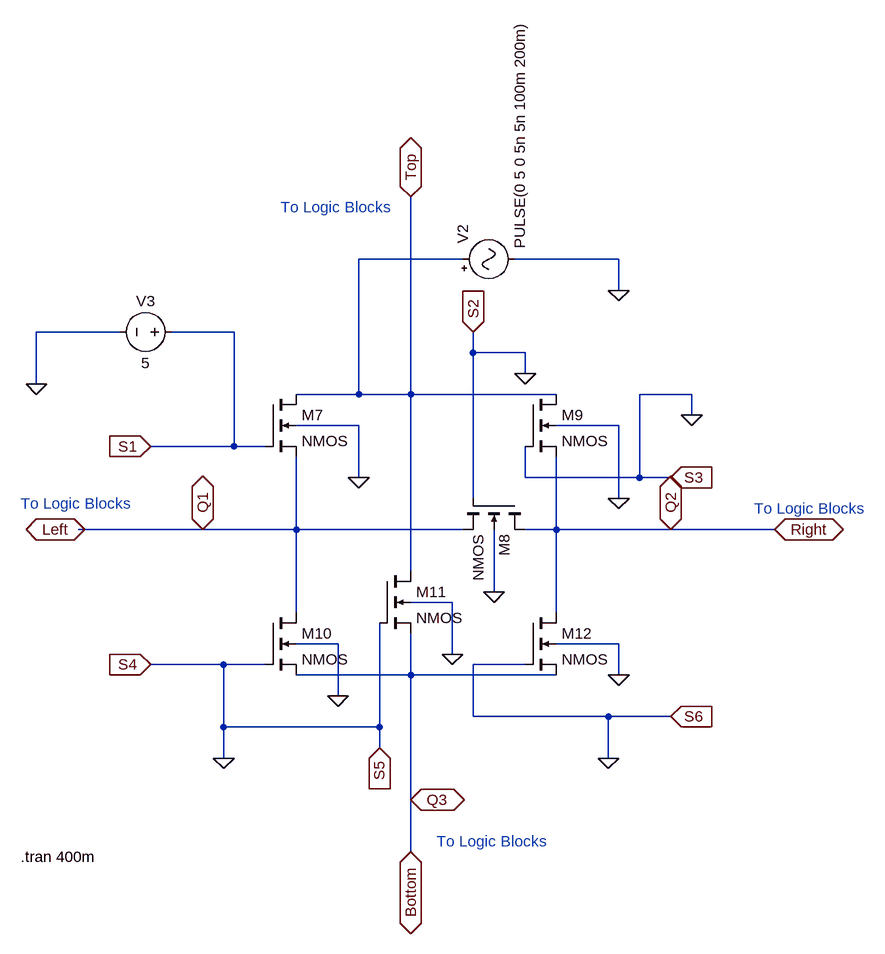
[diagram p0: schematic Circuit2_2_1.asc]
Circuit2_2_1.asc, the LTspice schematic file:
Version 4
SHEET 1 1812 896
WIRE 400 -160 240 -160
WIRE 640 -160 480 -160
WIRE 640 -112 640 -160
WIRE -128 -48 -256 -48
WIRE 48 -48 -48 -48
WIRE 416 -16 416 -48
WIRE 496 -16 416 -16
WIRE 496 16 496 -16
WIRE -256 32 -256 -48
WIRE 240 48 240 -160
WIRE 240 48 144 48
WIRE 320 48 320 -256
WIRE 320 48 240 48
WIRE 544 48 320 48
WIRE 752 48 672 48
WIRE 752 80 752 48
WIRE 240 96 144 96
WIRE 640 96 544 96
WIRE 48 128 48 -48
WIRE 48 128 -80 128
WIRE 96 128 48 128
WIRE 240 176 240 96
WIRE 496 176 496 128
WIRE 672 176 672 48
WIRE 672 176 496 176
WIRE 720 176 672 176
WIRE 416 208 416 -16
WIRE 640 208 640 96
WIRE 0 256 -192 256
WIRE 144 256 144 144
WIRE 144 256 0 256
WIRE 400 256 144 256
WIRE 544 256 544 144
WIRE 544 256 496 256
WIRE 720 256 544 256
WIRE 880 256 720 256
WIRE 320 320 320 48
WIRE 448 352 448 256
WIRE 384 368 320 368
WIRE 144 384 144 256
WIRE 544 384 544 256
WIRE 208 432 144 432
WIRE 640 432 544 432
WIRE 384 448 384 368
WIRE 32 464 -80 464
WIRE 96 464 32 464
WIRE 496 464 416 464
WIRE 320 480 320 416
WIRE 320 480 144 480
WIRE 544 480 320 480
WIRE 640 480 640 432
WIRE 208 512 208 432
WIRE 416 544 416 464
WIRE 624 544 416 544
WIRE 720 544 624 544
WIRE 32 560 32 464
WIRE 272 560 272 400
WIRE 272 560 32 560
WIRE 272 592 272 560
WIRE 32 608 32 560
WIRE 624 608 624 544
WIRE 320 672 320 480
WIRE 320 752 320 672
FLAG 240 176 0
FLAG 640 208 0
FLAG 448 352 0
FLAG 384 448 0
FLAG 640 480 0
FLAG 208 512 0
FLAG 320 -256 Top
IOPIN 320 -256 BiDir
FLAG 880 256 Right
IOPIN 880 256 BiDir
FLAG 320 752 Bottom
IOPIN 320 752 BiDir
FLAG -272 256 Left
IOPIN -272 256 BiDir
FLAG 416 -48 S2
IOPIN 416 -48 In
FLAG 720 176 S3
IOPIN 720 176 In
FLAG 720 544 S6
IOPIN 720 544 In
FLAG 272 592 S5
IOPIN 272 592 In
FLAG -80 464 S4
IOPIN -80 464 In
FLAG -80 128 S1
IOPIN -80 128 In
FLAG -256 32 0
FLAG 640 -112 0
FLAG 496 16 0
FLAG 752 80 0
FLAG 624 608 0
FLAG 32 608 0
FLAG 0 256 Q1
IOPIN 0 256 BiDir
FLAG 720 256 Q2
IOPIN 720 256 BiDir
FLAG 320 672 Q3
IOPIN 320 672 BiDir
SYMBOL nmos4 96 48 R0
SYMATTR InstName M7
SYMBOL nmos4 496 208 R90
SYMATTR InstName M8
SYMBOL nmos4 496 48 R0
SYMATTR InstName M9
SYMBOL nmos4 96 384 R0
SYMATTR InstName M10
SYMBOL nmos4 272 320 R0
SYMATTR InstName M11
SYMBOL nmos4 496 384 R0
SYMATTR InstName M12
SYMBOL Misc\\signal 384 -160 R270
WINDOW 3 16 104 Left 2
WINDOW 123 0 0 Left 0
WINDOW 39 0 0 Left 0
SYMATTR Value PULSE(0 5 0 5n 5n 100m 200m)
SYMATTR InstName V2
SYMBOL voltage -32 -48 R90
WINDOW 0 -32 56 VBottom 2
WINDOW 3 32 56 VTop 2
WINDOW 123 0 0 Left 0
WINDOW 39 0 0 Left 0
SYMATTR InstName V3
SYMATTR Value 5
TEXT 120 -240 Left 2 ;To Logic Blocks
TEXT 360 736 Left 2 ;To Logic Blocks
TEXT 848 224 Left 2 ;To Logic Blocks
TEXT -280 216 Left 2 ;To Logic Blocks
TEXT -280 760 Left 2 !.tran 400m

The netlist it stands for:
* Circuit2_2_1.asc
M7 Top S1 Q1 0 NMOS
M8 Q2 0 Q1 0 NMOS
M9 Top 0 Q2 0 NMOS
M10 Q1 0 Q3 0 NMOS
M11 Top 0 Q3 0 NMOS
M12 Q2 0 Q3 0 NMOS
V2 Top 0 PULSE(0 5 0 5n 5n 100m 200m)
V3 S1 0 5
.model NMOS NMOS
.model PMOS PMOS
.lib standard.mos
* To Logic Blocks
* To Logic Blocks
* To Logic Blocks
* To Logic Blocks
.tran 400m
.backanno
.end